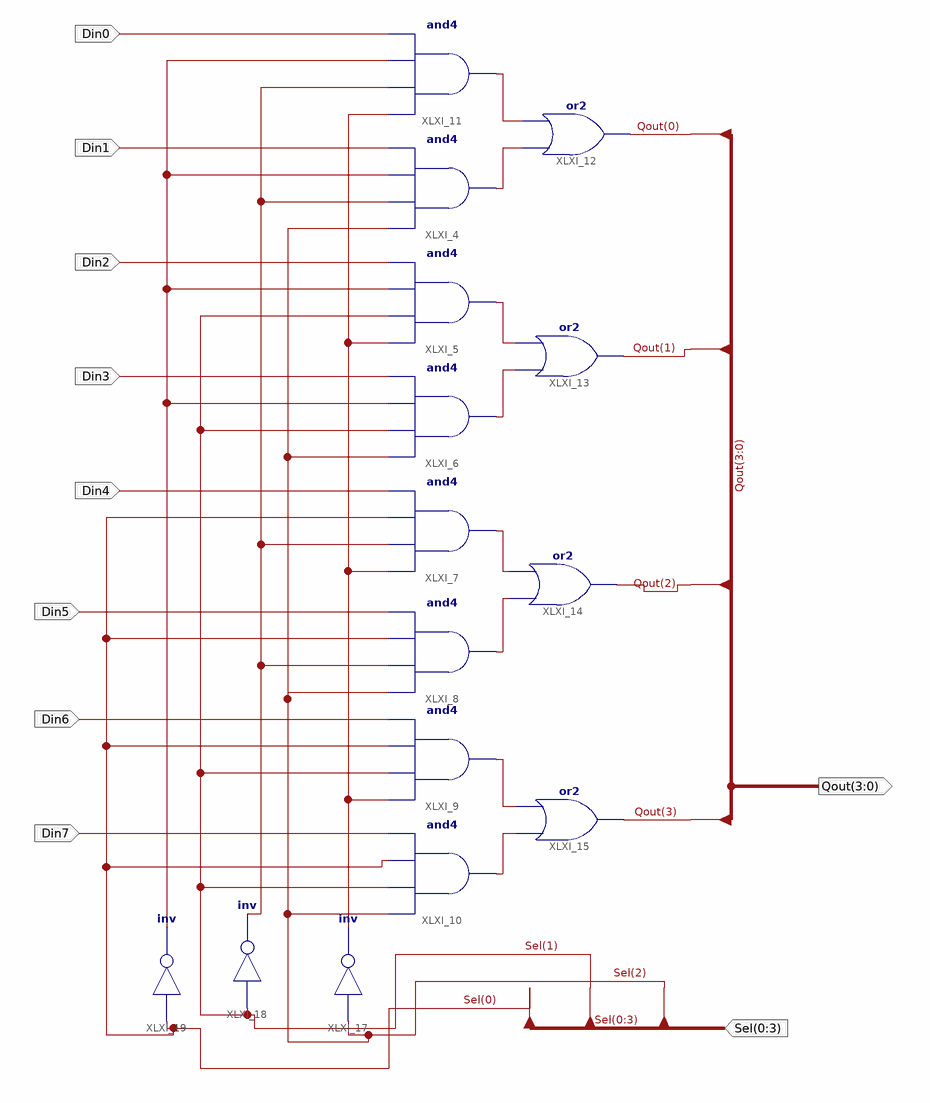
[diagram p0: schematic sheet 1]
// Xilinx ISE schematic eight2onemux.sch (spartan3e) as structural Verilog: 15 symbols, 10 ports
module eight2onemux (
  input  Din0,
  input  Din1,
  input  Din2,
  input  Din3,
  input  Din4,
  input  Din5,
  input  Din6,
  input  Din7,
  input  [0:3] Sel,
  output [3:0] Qout
);

  wire XLXN_17, XLXN_22, XLXN_28, XLXN_29, XLXN_32, XLXN_33, XLXN_34, XLXN_35, XLXN_36, XLXN_37;

  and XLXI_4 (XLXN_29, Sel[2], XLXN_17, XLXN_22, Din1);
  and XLXI_5 (XLXN_32, Sel[2], Sel[1], XLXN_22, Din2);
  and XLXI_6 (XLXN_33, Sel[2], Sel[1], XLXN_22, Din3);
  and XLXI_7 (XLXN_34, Sel[2], XLXN_17, Sel[0], Din4);
  and XLXI_8 (XLXN_35, Sel[2], XLXN_17, Sel[0], Din5);
  and XLXI_9 (XLXN_36, Sel[2], Sel[1], Sel[0], Din6);
  and XLXI_10 (XLXN_37, Sel[2], Sel[1], Sel[0], Din7);
  and XLXI_11 (XLXN_28, Sel[2], XLXN_17, XLXN_22, Din0);
  or XLXI_12 (Qout[0], XLXN_29, XLXN_28);
  or XLXI_13 (Qout[1], XLXN_33, XLXN_32);
  or XLXI_14 (Qout[2], XLXN_35, XLXN_34);
  or XLXI_15 (Qout[3], XLXN_37, XLXN_36);
  not XLXI_17 (Sel[2], Sel[2]);
  not XLXI_18 (XLXN_17, Sel[1]);
  not XLXI_19 (XLXN_22, Sel[0]);
endmodule
